# Altium schematic sheet tesis_page2_arm.SchDoc: ARM
size A4; Date: 01/04/2021; SheetNumber: 2; SheetTotal: 5
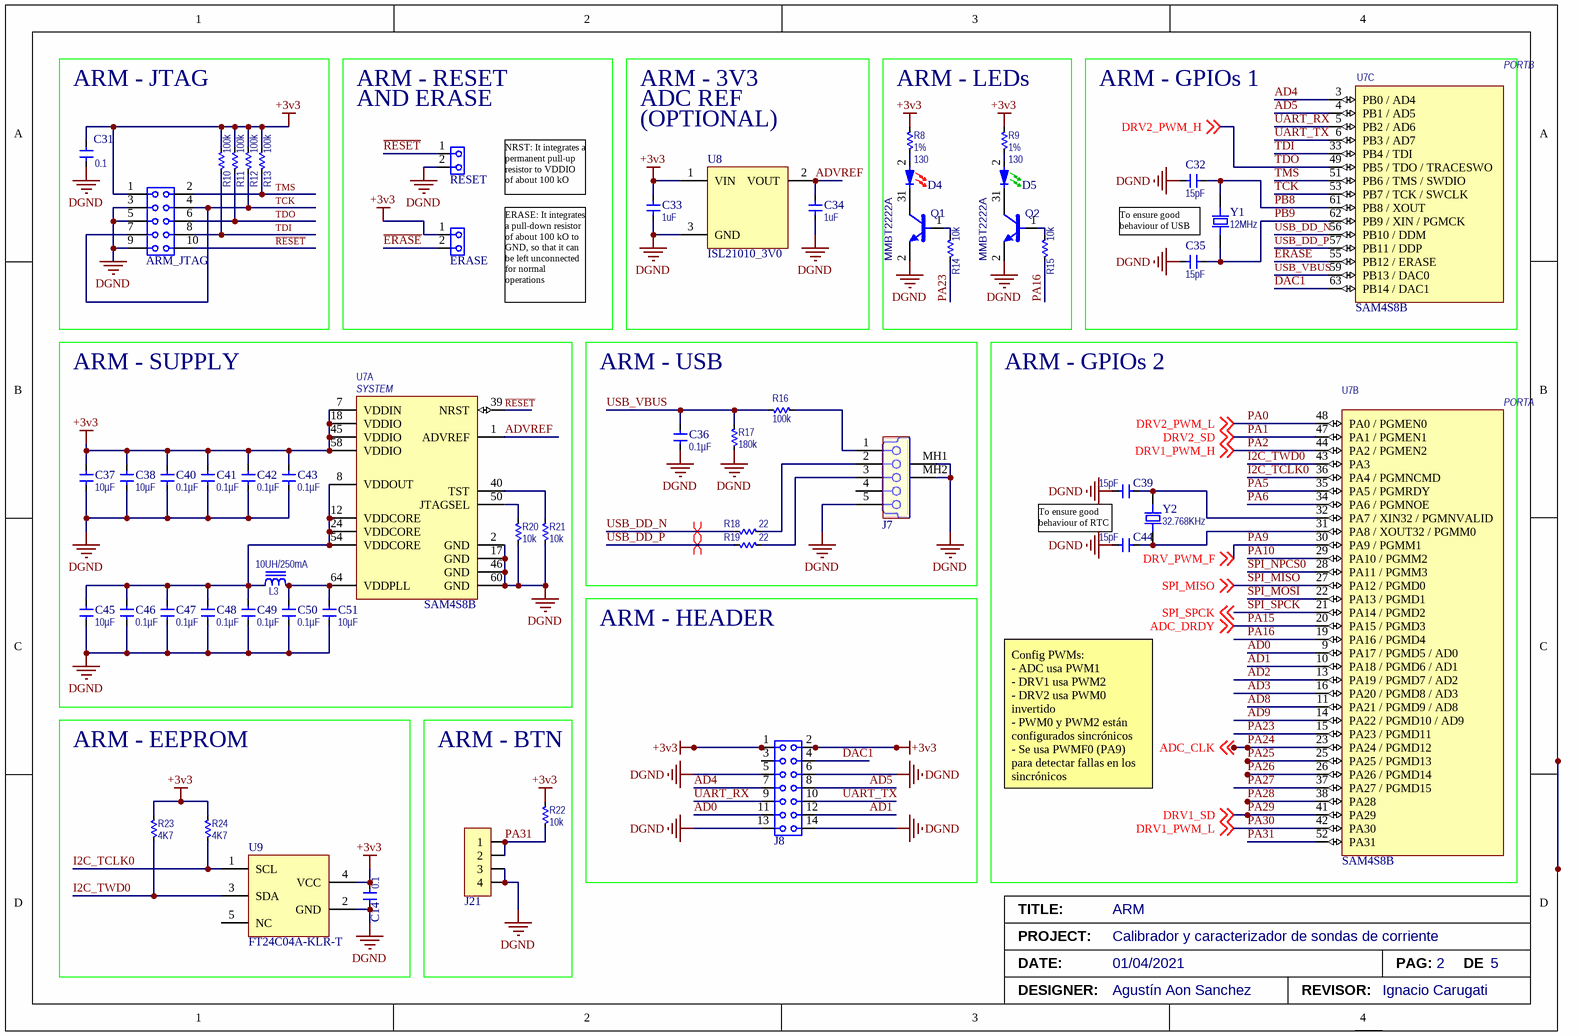
[diagram p0: tesis_page2_arm.SchDoc]

## Parts
ARM_JTAG  CON_20021121-00010C4LF_FCI  [FCI_20021121-00010C4LF]  (value not drawn)
C14  value 0.1  [CAPC2013X110N]  (hidden comment: CAP_CC0805KRX7R8BB104_YAGEO)
C31  value 0.1  [CAPC2013X110N]  (hidden comment: CAP_CC0805KRX7R8BB104_YAGEO)
C32  value 15pF  [CAPC2013X110N]  (hidden comment: CAP_C0805X150J5GACTU_KEMET)
C33  value 1uF  [CAPC2013X110N]  (hidden comment: CAP_CC0805KKX7R7BB105_YAGEO)
C34  value 1uF  [CAPC2013X110N]  (hidden comment: CAP_CC0805KKX7R7BB105_YAGEO)
C35  value 15pF  [CAPC2013X110N]  (hidden comment: CAP_C0805X150J5GACTU_KEMET)
C36  value 0.1µF  [CAPC2013X110N]  (hidden comment: CAP_CC0805KRX7R8BB104_YAGEO)
C37  value 10µF  [CAPC2013X110N]  (hidden comment: CAP_CL21A106KOCL3RC)
C38  value 10µF  [CAPC2013X110N]  (hidden comment: CAP_CL21A106KOCL3RC)
C39  value 15pF  [CAPC2013X110N]  (hidden comment: CAP_C0805X150J5GACTU_KEMET)
C40  value 0.1µF  [CAPC2013X110N]  (hidden comment: CAP_CC0805KRX7R8BB104_YAGEO)
C41  value 0.1µF  [CAPC2013X110N]  (hidden comment: CAP_CC0805KRX7R8BB104_YAGEO)
C42  value 0.1µF  [CAPC2013X110N]  (hidden comment: CAP_CC0805KRX7R8BB104_YAGEO)
C43  value 0.1µF  [CAPC2013X110N]  (hidden comment: CAP_CC0805KRX7R8BB104_YAGEO)
C44  value 15pF  [CAPC2013X110N]  (hidden comment: CAP_C0805X150J5GACTU_KEMET)
C45  value 10µF  [CAPC2013X110N]  (hidden comment: CAP_CL21A106KOCL3RC)
C46  value 0.1µF  [CAPC2013X110N]  (hidden comment: CAP_CC0805KRX7R8BB104_YAGEO)
C47  value 0.1µF  [CAPC2013X110N]  (hidden comment: CAP_CC0805KRX7R8BB104_YAGEO)
C48  value 0.1µF  [CAPC2013X110N]  (hidden comment: CAP_CC0805KRX7R8BB104_YAGEO)
C49  value 0.1µF  [CAPC2013X110N]  (hidden comment: CAP_CC0805KRX7R8BB104_YAGEO)
C50  value 0.1µF  [CAPC2013X110N]  (hidden comment: CAP_CC0805KRX7R8BB104_YAGEO)
C51  value 10µF  [CAPC2013X110N]  (hidden comment: CAP_CL21A106KOCL3RC)
D4  DIO_150080RS75000_WURTH  [DIO0805]  (value not drawn)
D5  DIO_150080VS75000_WURTH  [DIO0805]  (value not drawn)
ERASE  CON_Header_1x2  [RAD2]  (value not drawn)
J7  CON_MINI_USB  [UBS MiniB]  (value not drawn)
J8  CON_Header_CAL_1  [HeaderCAL_1]  (value not drawn)
J21  MSC_B3F-1000_OMRON  [SW_1825910-6]  (value not drawn)
L3  value 10UH/250mA  [INDC4532X170N]  (hidden comment: MAG_PM1812-100J-RC)
Q1  MMBT2222A  [SOT23-3M]
Q2  MMBT2222A  [SOT23-3M]
R8  value 130  Tolerance: 1%  [RESC2013X065BN]  (hidden comment: RES_RC0805FR-07130RL_YAGEO)
R9  value 130  Tolerance: 1%  [RESC2013X065BN]  (hidden comment: RES_RC0805FR-07130RL_YAGEO)
R10  value 100k  [RESC2013X065BN]  (hidden comment: RES_AC0805JR-07100KL_YAGEO)
R11  value 100k  [RESC2013X065BN]  (hidden comment: RES_AC0805JR-07100KL_YAGEO)
R12  value 100k  [RESC2013X065BN]  (hidden comment: RES_AC0805JR-07100KL_YAGEO)
R13  value 100k  [RESC2013X065BN]  (hidden comment: RES_AC0805JR-07100KL_YAGEO)
R14  value 10k  [RESC2013X065BN]  (hidden comment: RES_RC0805FR-0710KL_YAGEO)
R15  value 10k  [RESC2013X065BN]  (hidden comment: RES_RC0805FR-0710KL_YAGEO)
R16  value 100k  [RESC3216N]  (hidden comment: RES_RC1206JR-07100KL_YAGEO)
R17  value 180k  [RESC3216N]  (hidden comment: RES_RC1206JR-07180KL_YAGEO)
R18  value 22  [RESC2013X065BN]  (hidden comment: RES_AC0805JR-0722RL_YAGEO)
R19  value 22  [RESC2013X065BN]  (hidden comment: RES_AC0805JR-0722RL_YAGEO)
R20  value 10k  [RESC2013X065BN]  (hidden comment: RES_RC0805JR-0710KL_YAGEO)
R21  value 10k  [RESC2013X065BN]  (hidden comment: RES_RC0805JR-0710KL_YAGEO)
R22  value 10k  [RESC2013X065BN]  (hidden comment: RES_RC0805JR-0710KL_YAGEO)
R23  value 4K7  [RESC2013X065BN]  (hidden comment: RES_RC0805FR-074K7L_YAGEO)
R24  value 4K7  [RESC2013X065BN]  (hidden comment: RES_RC0805FR-074K7L_YAGEO)
RESET  CON_Header_1x2  [RAD2]  (value not drawn)
U7  SAM4S8B  [TQFP50P1000X1000X160-64N]  (parts A,B,C of 3)
U8  ISL21010_3V0  [SOT23-3M]
U9  FT24C04A-KLR-T  [SOT23-5AM]
Y1  value 12MHz  [CSM-3X]  (hidden comment: MSC_ECS-120-20-3X-TR_ECS)
Y2  value 32.768KHz  [XTAL3215X090N]  (hidden comment: MSC_ECS-.327-12.5-34S-TR_ECS)

## Blocks framed on the sheet
ARM - JTAG: ARM_JTAG C31 R10-R13
ARM - LEDs: D4 D5 Q1 Q2 R8 R9 R14 R15
ARM - GPIOs 1: C32 C35 U7 Y1
ARM - SUPPLY: C37 C38 C40-C43 C45-C51 L3 R20 R21 U7
ARM - USB: C36 J7 R16-R19
ARM - GPIOs 2: C39 C44 U7 Y2
ARM - HEADER: J8
ARM - EEPROM: C14 R23 R24 U9
ARM - BTN: J21 R22

## Nets
+3v3: ARM_JTAG.1 C14.2(T2) C31.1(T1) C33.1(T1) C37.2(T2) C38.2(T2) C40.2(T2) C41.2(T2) C42.2(T2) C43.2(T2) ERASE.1 J8.1 J8.2 R8.2(T2) R9.2(T2) R10.2(T2) R11.2(T2) R12.2(T2) R13.2(T2) R22.2(T2) R23.2(T2) R24.2(T2) U7.7(VDDIN) U7.18(VDDIO) U7.45(VDDIO) U7.58(VDDIO) U8.1(VIN) U9.4(VCC)
DGND: ARM_JTAG.3 ARM_JTAG.5 ARM_JTAG.9 C14.1(T1) C31.2(T2) C32.2(T2) C33.2(T2) C34.2(T2) C35.1(T1) C36.1(T1) C37.1(T1) C38.1(T1) C39.2(T2) C40.1(T1) C41.1(T1) C42.1(T1) C43.1(T1) C44.2(T2) C45.1(T1) C46.2(T2) C47.2(T2) C48.2(T2) C49.2(T2) C50.1(T1) C51.2(T2) J7.5 J7.MH1 J7.MH2 J8.5 J8.6 J8.13 J8.14 J21.3 J21.4 Q1.2(E) Q2.2(E) R17.2(T2) R20.1(T1) R21.1(T1) RESET.2 U7.2(GND) U7.17(GND) U7.46(GND) U7.60(GND) U8.3(GND) U9.2(GND)
AD0: J8.11 U7.9(PA17_/_PGMD5_/_AD0)
AD1: J8.12 U7.10(PA18_/_PGMD6_/_AD1)
AD2: U7.13(PA19_/_PGMD7_/_AD2)
AD3: U7.16(PA20_/_PGMD8_/_AD3)
AD4: J8.7 U7.3(PB0_/_AD4)
AD5: J8.8 U7.4(PB1_/_AD5)
AD8: U7.11(PA21_/_PGMD9_/_AD8)
AD9: U7.14(PA22_/_PGMD10_/_AD9)
ADVREF: C34.1(T1) U7.1(ADVREF) U8.2(VOUT)
DAC1: J8.4 U7.63(PB14_/_DAC1)
~{ERASE}: ERASE.2 U7.55(PB12_/_ERASE)
I2C_TCLK0: R24.1(T1) U7.36(PA4_/_PGMNCMD) U9.1(SCL)
I2C_TWD0: R23.1(T1) U7.43(PA3) U9.3(SDA)
PA0: U7.48(PA0_/_PGMEN0) ; off-sheet DRV2_PWM_L  [also labelled DRV2_PWM_L]
PA1: U7.47(PA1_/_PGMEN1) ; off-sheet DRV2_SD  [also labelled DRV2_SD]
PA2: U7.44(PA2_/_PGMEN2) ; off-sheet DRV1_PWM_H  [also labelled DRV1_PWM_H]
PA5: U7.35(PA5_/_PGMRDY)
PA6: U7.34(PA6_/_PGMNOE)
PA9: U7.30(PA9_/_PGMM1) ; off-sheet DRV_PWM_F  [also labelled DRV_PWM_F]
PA10: U7.29(PA10_/_PGMM2)
PA15: U7.20(PA15_/_PGMD3) ; off-sheet ADC_DRDY  [also labelled ADC_DRDY]
PA16: R15.2(T2) U7.19(PA16_/_PGMD4)
PA23: R14.2(T2) U7.15(PA23_/_PGMD11)
PA24: U7.23(PA24_/_PGMD12) ; off-sheet ADC_CLK  [also labelled ADC_CLK]
PA25: U7.25(PA25_/_PGMD13)
PA26: U7.26(PA26_/_PGMD14)
PA27: U7.37(PA27_/_PGMD15)
PA28: U7.38(PA28)
PA29: U7.41(PA29) ; off-sheet DRV1_SD  [also labelled DRV1_SD]
PA30: U7.42(PA30) ; off-sheet DRV1_PWM_L  [also labelled DRV1_PWM_L]
PA31: J21.1 J21.2 R22.1(T1) U7.52(PA31)
PB8: C32.1(T1) U7.61(PB8_/_XOUT) Y1.2
PB9: C35.2(T2) U7.62(PB9_/_XIN_/_PGMCK) Y1.1
~{RESET}: ARM_JTAG.10 RESET.1 U7.39(NRST)
SPI_MISO: U7.27(PA12_/_PGMD0) ; off-sheet SPI_MISO
SPI_MOSI: U7.22(PA13_/_PGMD1)
SPI_NPCS0: U7.28(PA11_/_PGMM3)
SPI_SPCK: U7.21(PA14_/_PGMD2) ; off-sheet SPI_SPCK
TCK: ARM_JTAG.4 ARM_JTAG.7 R12.1(T1) U7.53(PB7_/_TCK_/_SWCLK)
TDI: ARM_JTAG.8 R10.1(T1) U7.33(PB4_/_TDI)
TDO: ARM_JTAG.6 R11.1(T1) U7.49(PB5_/_TDO_/_TRACESWO) ; off-sheet DRV2_PWM_H  [also labelled DRV2_PWM_H]
TMS: ARM_JTAG.2 R13.1(T1) U7.51(PB6_/_TMS_/_SWDIO)
UART_RX: J8.9 U7.5(PB2_/_AD6)
UART_TX: J8.10 U7.6(PB3_/_AD7)
USB_DD_N: R18.2(T2) U7.56(PB10_/_DDM)
USB_DD_P: R19.2(T2) U7.57(PB11_/_DDP)
USB_VBUS: C36.2(T2) R16.2(T2) R17.1(T1) U7.59(PB13_/_DAC0)
NetC39_1: C39.1(T1) U7.32(PA7_/_XIN32_/_PGMNVALID) Y2.2
NetC44_1: C44.1(T1) U7.31(PA8_/_XOUT32_/_PGMM0) Y2.1
NetC45_2: C45.2(T2) C46.1(T1) C47.1(T1) C48.1(T1) C49.1(T1) L3.1 U7.8(VDDOUT) U7.12(VDDCORE) U7.24(VDDCORE) U7.54(VDDCORE)
NetC50_2: C50.2(T2) C51.1(T1) L3.2 U7.64(VDDPLL)
NetD4_1: D4.1(Cathode) Q1.3(C)
NetD4_2: D4.2(Anode) R8.1(T1)
NetD5_1: D5.1(Cathode) Q2.3(C)
NetD5_2: D5.2(Anode) R9.1(T1)
NetJ7_1: J7.1 R16.1(T1)
NetJ7_2: J7.2 R18.1(T1)
NetJ7_3: J7.3 R19.1(T1)
NetQ1_1: Q1.1(B) R14.1(T1)
NetQ2_1: Q2.1(B) R15.1(T1)
NetR20_2: R20.2(T2) U7.50(JTAGSEL)
NetR21_2: R21.2(T2) U7.40(TST)

Not connected (* = marked no-connect by the designer): J7 4; J8 3; U9 5(NC)

## Layout directives
differential pair: USB_DD_N, USB_DD_P

## Notes on the sheet
- ARM - RESET
- (near RESET) AND ERASE
- ARM - 3V3
- ADC REF
- (OPTIONAL)
- NRST: It integrates a permanent pull-up resistor to VDDIO of about 100 kO
- To ensure good behaviour of USB
- ERASE: It integrates a pull-down resistor of about 100 kO to GND, so that it can be left unconnected for normal operations
- To ensure good behaviour of RTC
- Config PWMs:
  - ADC usa PWM1
  - DRV1 usa PWM2
  - DRV2 usa PWM0 invertido
  - PWM0 y PWM2 están configurados sincrónicos
  - Se usa PWMF0 (PA9) para detectar fallas en los sincrónicos
- TITLE:
- PROJECT:
- DATE:
- DESIGNER:
- Calibrador y caracterizador de sondas de corriente
- 01/04/2021
- Agustín Aon Sanchez
- REVISOR:
- Ignacio Carugati
- PAG:
- DE
- (in symbol IC_ATSAM4S8BA-AU_ATMEL, part A) SYSTEM
- (in symbol IC_ATSAM4S8BA-AU_ATMEL, part B) PORTA
- (in symbol IC_ATSAM4S8BA-AU_ATMEL, part C) PORTB

## Library data of the parts
ARM_JTAG = CON_20021121-00010C4LF_FCI: CONN HEADER 10POS DL UNSHRD SMD; Manufacturer: FCI; BOM Populate: *; Tolerance: *; Supplier Part No: *; Supplier: *; Voltage Rating: *; Value: 20021121-00010C4LF; Current Rating: *; Digikey Part Number: 609-3695-1-ND; Manufacturer Part Number: 20021121-00010C4LF; Mouser Part Number: 649-202112100010C4LF
C14 C31 C36 C40-C43 C46-C50 = CAP_CC0805KRX7R8BB104_YAGEO: CAP CER 0.1UF 25V 10% X7R 0805; Manufacturer: Yageo; Supplier: *; Tolerance: 10%; Power Rating: *; Voltage Rating: 25V; BOM Populate: *; Digikey Part Number: 311-1141-1-ND; Mouser Part Number: 603-CC805KRX7R8BB104; Manufacturer Part Number: CC0805KRX7R8BB104
C32 C35 C39 C44 = CAP_C0805X150J5GACTU_KEMET: CAP CER 15PF 50V NP0 0805; Manufacturer: Kemet; Tolerance: 5%; Digikey Part Number: 399-7428-1-ND; Supplier: *; Power Rating: *; Voltage Rating: 50V; BOM Populate: *; Mouser Part Number: 80-C0805X150J5G; Manufacturer Part Number: C0805X150J5GACTU
C33 C34 = CAP_CC0805KKX7R7BB105_YAGEO: CAP CER 1UF 16V X7R 0805; Manufacturer: YAGEO; Tolerance: 10%; Supplier: *; Supplier Part No: *; Power Rating: *; BOM Populate: *; Voltage Rating: 16V; Digikey Part Number: 311-1365-1-ND; Mouser Part Number: 603-CC805KKX7R7BB105; Manufacturer Part Number: CC0805KKX7R7BB105
C37 C38 C45 C51 = CAP_CL21A106KOCL3RC: CAP CER 10UF 16V X5R 0805; Manufacturer: Samsung; Tolerance: 10%; Voltage Rating: 16V; Manufacturer Part Number: CL21A106KOCL3RC; Supplier 1: Future Electronics; RoHS: Yes; Category: Ceramic Capacitors; Stock 1: 3934; Pricing 1: 1=0,10400, 50=0,08230, 100=0,07900, 500=0,07190, 1500=0,06740 (USD); Mount: Surface Mount; Case/Package: 0805; Case Code (Metric): 2012; Case Code (Imperial): 0805; Min Operating Temperature: -55°C; Max Operating Temperature: 85°C; Package Quantity: 1; Packaging: Tape and Reel; Length: 0.079inch; Width: 0.049inch; Thickness: 0.037inch; ComponentLink1URL: https://datasheet.ciiva.com/25796/cl21a106kocl3rc-25796224.pdf?src-supplier=Digi-Key; ComponentLink1Description: https://datasheet.ciiva.com/25796/cl21a106kocl3rc-25796224.pdf?src-supplier=Digi-Key; Supplier Part Number 1: 8109145; Capacitance: 10µF
D4 = DIO_150080RS75000_WURTH: LED RED CLEAR 0805 SMD; Manufacturer: Wurth Electronics Inc.; Manufacturer Part Number: 150080RS75000; Digikey Part Number: 732-4984-1-ND; Mouser Part Number: 710-150080RS75000
D5 = DIO_150080VS75000_WURTH: LED GREEN CLEAR 0805 SMD; Manufacturer: Wurth Electronics Inc.; Manufacturer Part Number: 150080VS75000; Digikey Part Number: 732-4986-1-ND; Mouser Part Number: 710-150080VS75000
J7 = CON_MINI_USB: CONN RCPT MINI USB2.0 5POS SLD; Manufacturer Part Number: UX60SC-MB-5S8; Manufacturer: Hirose Electric Co Ltd; Digikey Part Number: H11589CT-ND; Mouser Part Number: 798-UX60SC-MB-5S8
J21 = MSC_B3F-1000_OMRON: SWITCH TACTILE SPST-NO 0.05A 24V; Manufacturer: Omron Electronics Inc-EMC Div; Mouser Part Number: 653-B3F-1000; Manufacturer Part Number: B3F-1000; Digikey Part Number: SW400-ND
L3 = MAG_PM1812-100J-RC: FIXED IND 10UH 250mA 1.6 OHM SMD; Manufacturer: Bourns Inc; Manufacturer Part Number: CM453232-100KL; BOM Populate: *; Current Rating: *; Supplier: *; Supplier Part No: *; Voltage Rating: *; Tolerance: *; Digikey Part Number: CM453232-100KLCT-ND; Mouser Part Number: 652-CM453232-100KL
Q1 Q2 = Q_MMBT2222A-7-F_DIODES: TRANS NPN 40V 0.6A SMD SOT23-3; Manufacturer Part Number: MMBT2222A-FDICT-ND; Mouser Part Number: 621-MMBT2222A-F; Digikey Part Number: MMBT2222A-7-F
R8 R9 = RES_RC0805FR-07130RL_YAGEO: RES SMD 130 OHM 1% 1/8W 0805; Manufacturer: Yageo; BOM Populate: *; Supplier Part No: *; Supplier: *; Digikey Part Number: 311-130CRCT-ND; Power Rating: 1/8W; Manufacturer Part Number: RC0805FR-07130RL; Mouser Part Number: 603-RC0805FR-07130RL
R10-R13 = RES_AC0805JR-07100KL_YAGEO: RES SMD 100K OHM 5% 1/8W 0805; Manufacturer: Yageo; BOM Populate: *; Supplier Part No: *; Supplier: *; Tolerance: 5%; Digikey Part Number: YAG3756CT-ND; Power Rating: 1/8W; Manufacturer Part Number: AC0805JR-07100KL; Mouser Part Number: 603-AC0805JR-07100KL
R14 R15 = RES_RC0805FR-0710KL_YAGEO: RES SMD 10K OHM 1% 1/8W 0805; Manufacturer: Yageo; BOM Populate: *; Supplier Part No: *; Supplier: *; Digikey Part Number: 311-10.0KCRCT-ND; Power Rating: 1/8W; Manufacturer Part Number: RC0805FR-0710KL; Mouser Part Number: 603-RC0805FR-0710KL; Tolerance: 1%
R16 = RES_RC1206JR-07100KL_YAGEO: RES SMD 100K OHM 5% 1/4W 1206; Manufacturer: YAGEO; Tolerance: 5%; BOM Populate: *; Digikey Part Number: 311-100KERCT-ND; Power Rating: 1/4W; Manufacturer Part Number: RC1206JR-07100KL; Mouser Part Number: 603-RC1206JR-07100KL
R17 = RES_RC1206JR-07180KL_YAGEO: RES SMD 180K OHM 5% 1/4W 1206; Manufacturer: YAGEO; Tolerance: 5%; BOM Populate: *; Digikey Part Number: 311-180KERCT-ND; Power Rating: 1/4W; Manufacturer Part Number: RC1206JR-07180KL; Mouser Part Number: 603-RC1206JR-07180KL
R18 R19 = RES_AC0805JR-0722RL_YAGEO: RES SMD 22 OHM 5% 1/8W 0805; Manufacturer: Yageo; Tolerance: 5%; BOM Populate: *; Supplier Part No: *; Supplier: *; Digikey Part Number: 311-22ARCT-ND; Power Rating: 1/8W; Manufacturer Part Number: AC0805JR-0722RL; Mouser Part Number: 603-AC0805JR-0722RL
R20-R22 = RES_RC0805JR-0710KL_YAGEO: RES SMD 10K OHM 5% 1/8W 0805; Manufacturer: Yageo; BOM Populate: *; Supplier Part No: *; Supplier: *; Tolerance: 5%; Digikey Part Number: 311-10KARCT-ND; Power Rating: 1/8W; Manufacturer Part Number: RC0805JR-0710KL; Mouser Part Number: 603-RC0805JR-0710KL
R23 R24 = RES_RC0805FR-074K7L_YAGEO: RES SMD 4.7K OHM 1% 1/8W 0805; Manufacturer: Yageo; BOM Populate: *; Supplier Part No: *; Supplier: *; Digikey Part Number: 311-4.70KCRCT-ND; Power Rating: 1/8W; Manufacturer Part Number: RC0805FR-074K7L; Mouser Part Number: 603-RC0805FR-074K7L; Tolerance: 1%
U7 = IC_ATSAM4S8BA-AU_ATMEL: IC MCU 32BIT 512KB FLASH 64LQFP; Manufacturer: Atmel; BOM Populate: *; Power Rating: *; Supplier: *; Supplier Part No: *; Tolerance: *; Value: ATSAM4S; Voltage Rating: *; Digikey Part Number: ATSAM4S8BA-AU-ND; Manufacturer Part Number: ATSAM4S8BA-AU; Mouser Part Number: 556-ATSAM4S8BA-AU
U8 = IC_ISL21010_3V0_INTERSIL: IC VREF SERIES 3V SOT23-3; Manufacturer Part Number: ISL21010CFH330Z-TK; Digikey Part Number: ISL21010CFH330Z-TKCT-ND; Mouser Part Number: 968-ISL21010CFH330ZT
U9 = IC_FT24C04A-KLR-T: Manufacturer: Fremont Micro Devices; Memory Type: Non-Volatile,EEPROM; Memory Size: 4Kb; Frequency: 1MHz; Access Time: 550ns; Supplier 1: Digi-Key; Supplier Part Number 1: 1219-1227-2-ND; Manufacturer Part Number: FT24C04A-KLR-T; RoHS: No; Category: Memory; Stock 1: 3000; Pricing 1: 3000=0,14616 (USD); Mount: Surface Mount; Case/Package: SOT-23-5; Min Operating Temperature: -40°C; Max Operating Temperature: 85°C; ComponentLink1URL: https://img1.wsimg.com/blobby/go/d0f1813f-418c-4780-8b0e-f456f226885c/downloads/1bs92tefg_846599.pdf?src-supplier=Digi-Key; ComponentLink1Description: https://img1.wsimg.com/blobby/go/d0f1813f-418c-4780-8b0e-f456f226885c/downloads/1bs92tefg_846599.pdf?src-supplier=Digi-Key
Y1 = MSC_ECS-120-20-3X-TR_ECS: 12 MHz ±30 ppm Cristales 20 pF 60 Ohm -10°C ~ 70°C Montaje en superficie HC49/US; Manufacturer: ECS Inc.; BOM Populate: *; Digikey Part Number: XC1770DKR-ND; Supplier: *; Supplier Part No: *; Tolerance: *; Power Rating: *; Voltage Rating: *; Manufacturer Part Number: ECS-120-20-3X-TR; Mouser Part Number: 520-120-20-3XT
Y2 = MSC_ECS-.327-12.5-34S-TR_ECS: CRYSTAL 32.7680KHZ 12.5PF SMD; Manufacturer: ECS; BOM Populate: *; Digikey Part Number: XC1967CT-ND; Supplier: *; Supplier Part No: *; Tolerance: *; Power Rating: *; Voltage Rating: *; Manufacturer Part Number: ECS-.327-12.5-34S-TR; Mouser Part Number: 520-ECS32.7-12.534ST